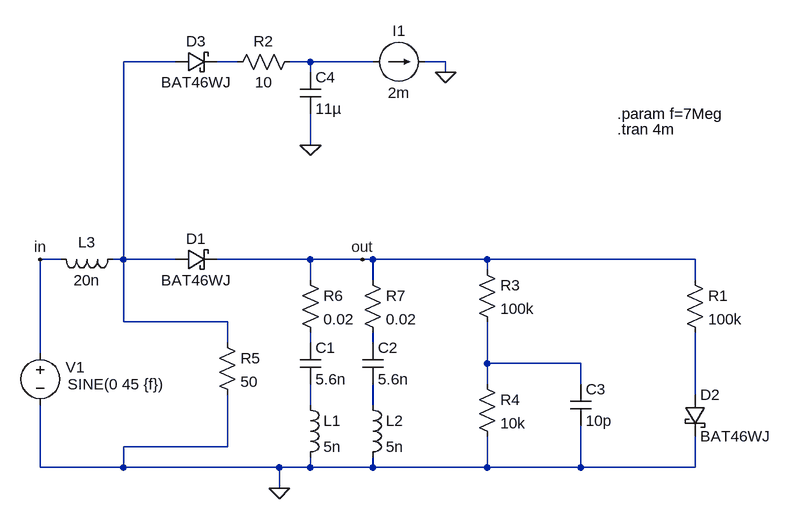
[diagram p0: schematic peak_detector_power_error_calc.asc]
peak_detector_power_error_calc.asc, the LTspice schematic file:
Version 4
SHEET 1 1120 680
WIRE 96 -256 16 -256
WIRE 192 -256 160 -256
WIRE 304 -256 272 -256
WIRE 400 -256 304 -256
WIRE 512 -256 480 -256
WIRE 304 -240 304 -256
WIRE 512 -240 512 -256
WIRE 304 -128 304 -176
WIRE -80 48 -112 48
WIRE 16 48 16 -256
WIRE 16 48 0 48
WIRE 96 48 16 48
WIRE 304 48 160 48
WIRE 384 48 304 48
WIRE 400 48 384 48
WIRE 576 48 400 48
WIRE 896 48 576 48
WIRE 576 64 576 48
WIRE 304 80 304 48
WIRE 400 80 400 48
WIRE 896 80 896 48
WIRE 16 144 16 48
WIRE 176 144 16 144
WIRE 176 176 176 144
WIRE 304 176 304 160
WIRE 400 176 400 160
WIRE -112 192 -112 48
WIRE 576 208 576 144
WIRE 720 208 576 208
WIRE 576 240 576 208
WIRE 720 240 720 208
WIRE 896 256 896 160
WIRE 304 272 304 240
WIRE 400 272 400 240
WIRE 176 336 176 256
WIRE 176 336 16 336
WIRE -112 368 -112 272
WIRE 16 368 16 336
WIRE 16 368 -112 368
WIRE 256 368 16 368
WIRE 304 368 304 352
WIRE 304 368 256 368
WIRE 400 368 400 352
WIRE 400 368 304 368
WIRE 576 368 576 320
WIRE 576 368 400 368
WIRE 720 368 720 304
WIRE 720 368 576 368
WIRE 896 368 896 320
WIRE 896 368 720 368
WIRE 256 400 256 368
FLAG 384 48 out
FLAG -112 48 in
FLAG 256 400 0
FLAG 304 -128 0
FLAG 512 -240 0
SYMBOL cap 288 176 R0
SYMATTR InstName C1
SYMATTR Value 5.6n
SYMBOL schottky 96 64 R270
WINDOW 0 32 32 VTop 2
WINDOW 3 0 32 VBottom 2
SYMATTR InstName D1
SYMATTR Value BAT46WJ
SYMATTR Description Diode
SYMATTR Type diode
SYMBOL voltage -112 176 R0
WINDOW 3 42 64 Left 2
WINDOW 123 24 124 Left 2
WINDOW 39 0 0 Left 0
WINDOW 0 39 38 Left 2
SYMATTR Value SINE(0 45 {f})
SYMATTR InstName V1
SYMBOL cap 384 176 R0
SYMATTR InstName C2
SYMATTR Value 5.6n
SYMBOL res 560 48 R0
SYMATTR InstName R3
SYMATTR Value 100k
SYMBOL res 560 224 R0
SYMATTR InstName R4
SYMATTR Value 10k
SYMBOL cap 704 240 R0
SYMATTR InstName C3
SYMATTR Value 10p
SYMBOL schottky 880 256 R0
SYMATTR InstName D2
SYMATTR Value BAT46WJ
SYMATTR Description Diode
SYMATTR Type diode
SYMBOL res 880 64 R0
SYMATTR InstName R1
SYMATTR Value 100k
SYMBOL schottky 96 -240 R270
WINDOW 0 32 32 VTop 2
WINDOW 3 0 32 VBottom 2
SYMATTR InstName D3
SYMATTR Value BAT46WJ
SYMATTR Description Diode
SYMATTR Type diode
SYMBOL res 288 -272 R90
WINDOW 0 0 56 VBottom 2
WINDOW 3 32 56 VTop 2
SYMATTR InstName R2
SYMATTR Value 10
SYMBOL cap 288 -240 R0
SYMATTR InstName C4
SYMATTR Value 11µ
SYMBOL current 400 -256 R270
WINDOW 0 32 40 VTop 2
WINDOW 3 -32 40 VBottom 2
WINDOW 123 0 0 Left 0
WINDOW 39 0 0 Left 0
SYMATTR InstName I1
SYMATTR Value 2m
SYMBOL res 160 160 R0
SYMATTR InstName R5
SYMATTR Value 50
SYMBOL ind 288 256 R0
SYMATTR InstName L1
SYMATTR Value 5n
SYMBOL ind 384 256 R0
SYMATTR InstName L2
SYMATTR Value 5n
SYMBOL res 288 64 R0
SYMATTR InstName R6
SYMATTR Value 0.02
SYMBOL res 384 64 R0
SYMATTR InstName R7
SYMATTR Value 0.02
SYMBOL ind 16 32 R90
WINDOW 0 5 56 VBottom 2
WINDOW 3 32 56 VTop 2
SYMATTR InstName L3
SYMATTR Value 20n
TEXT 776 -176 Left 2 !.param f=7Meg
TEXT 776 -152 Left 2 !.tran 4m

The netlist it stands for:
* peak_detector_power_error_calc.asc
C1 N004 N008 5.6n
D1 N001 out BAT46WJ
V1 in 0 SINE(0 45 {f})
C2 N005 N009 5.6n
R3 out N006 100k
R4 N006 0 10k
C3 N006 0 10p
D2 N007 0 BAT46WJ
R1 out N007 100k
D3 N001 N002 BAT46WJ
R2 N003 N002 10
C4 N003 0 11µ
I1 N003 0 2m
R5 N001 0 50
L1 N008 0 5n
L2 N009 0 5n
R6 out N004 0.02
R7 out N005 0.02
L3 N001 in 20n
.model D D
.lib standard.dio
.param f=7Meg
.tran 4m
.backanno
.end